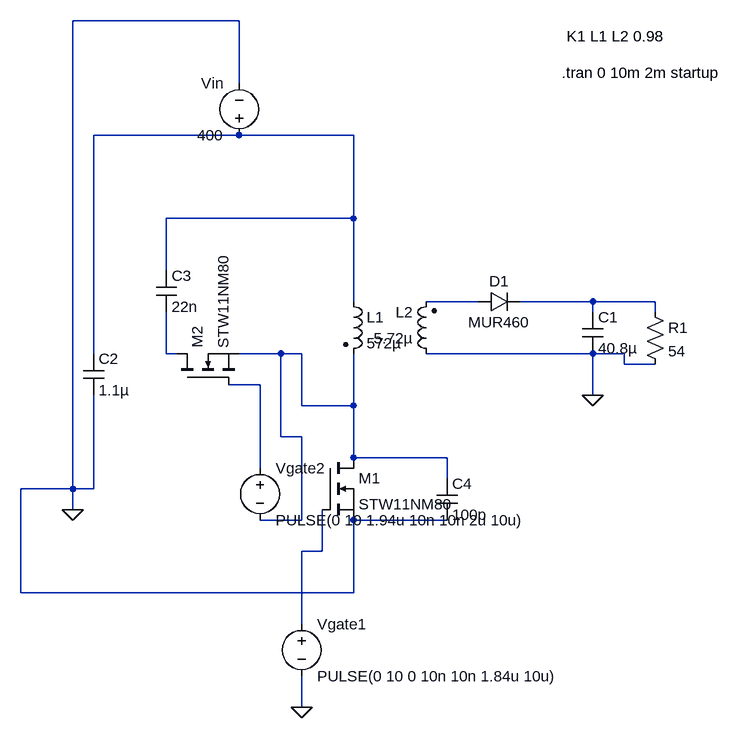
[diagram p0: schematic Draft3.asc]
Draft3.asc, the LTspice schematic file:
Version 4
SHEET 1 880 740
WIRE 0 -336 -256 -336
WIRE 0 -240 0 -336
WIRE 0 -160 -224 -160
WIRE 176 -160 0 -160
WIRE 176 -32 176 -160
WIRE 176 -32 -112 -32
WIRE -112 48 -112 -32
WIRE 176 96 176 -32
WIRE 368 96 288 96
WIRE 544 96 432 96
WIRE 640 96 544 96
WIRE 544 112 544 96
WIRE 640 112 640 96
WIRE -224 176 -224 -160
WIRE -112 176 -112 112
WIRE -96 176 -112 176
WIRE 64 176 0 176
WIRE 96 176 64 176
WIRE 544 176 288 176
WIRE 592 176 544 176
WIRE 592 192 592 176
WIRE 640 192 592 192
WIRE 32 224 -16 224
WIRE 544 240 544 176
WIRE 96 256 96 176
WIRE 176 256 176 176
WIRE 176 256 96 256
WIRE 64 304 64 176
WIRE 96 304 64 304
WIRE 176 336 176 256
WIRE 320 336 176 336
WIRE 32 352 32 224
WIRE 320 368 320 336
WIRE -256 384 -256 -336
WIRE -256 384 -336 384
WIRE -224 384 -224 240
WIRE -224 384 -256 384
WIRE -256 416 -256 384
WIRE 96 432 96 304
WIRE 96 432 32 432
WIRE 320 432 176 432
WIRE 128 480 128 416
WIRE 128 480 96 480
WIRE -336 544 -336 384
WIRE 176 544 176 432
WIRE 176 544 -336 544
WIRE 96 592 96 480
WIRE 96 720 96 672
FLAG -256 416 0
FLAG 96 720 0
FLAG 544 240 0
SYMBOL ind2 160 80 R0
SYMATTR InstName L1
SYMATTR Value 572µ
SYMATTR Type ind
SYMBOL ind2 304 192 R180
WINDOW 0 36 80 Left 2
WINDOW 3 36 40 Left 2
SYMATTR InstName L2
SYMATTR Value 5.72µ
SYMATTR Type ind
SYMBOL diode 368 112 R270
WINDOW 0 32 32 VTop 2
WINDOW 3 0 32 VBottom 2
SYMATTR InstName D1
SYMATTR Value MUR460
SYMBOL cap 528 112 R0
SYMATTR InstName C1
SYMATTR Value 40.8µ
SYMBOL nmos 128 336 R0
SYMATTR InstName M1
SYMATTR Value STW11NM80
SYMBOL nmos -96 224 R270
SYMATTR InstName M2
SYMATTR Value STW11NM80
SYMBOL cap -240 176 R0
SYMATTR InstName C2
SYMATTR Value 1.1µ
SYMBOL cap 304 368 R0
SYMATTR InstName C4
SYMATTR Value 100p
SYMBOL cap -128 48 R0
SYMATTR InstName C3
SYMATTR Value 22n
SYMBOL voltage 0 -144 R180
WINDOW 0 24 96 Left 2
WINDOW 3 24 16 Left 2
WINDOW 123 0 0 Left 0
WINDOW 39 0 0 Left 0
SYMATTR InstName Vin
SYMATTR Value 400
SYMBOL voltage 96 576 R0
WINDOW 123 0 0 Left 0
WINDOW 39 0 0 Left 0
SYMATTR InstName Vgate1
SYMATTR Value PULSE(0 10 0 10n 10n 1.84u 10u)
SYMBOL voltage 32 336 R0
WINDOW 123 0 0 Left 0
WINDOW 39 0 0 Left 0
SYMATTR InstName Vgate2
SYMATTR Value PULSE(0 10 1.94u 10n 10n 2u 10u)
SYMBOL res 624 96 R0
SYMATTR InstName R1
SYMATTR Value 54
TEXT 504 -312 Left 2 !K1 L1 L2 0.98
TEXT 496 -256 Left 2 !.tran 0 10m 2m startup

The netlist it stands for:
* Draft3.asc
L1 N001 N005 572µ
L2 0 N002 5.72µ
D1 N002 N003 MUR460
C1 N003 0 40.8µ
M1 N005 N007 0 0 STW11NM80
M2 N004 N006 N005 N005 STW11NM80
C2 N001 0 1.1µ
C4 N005 0 100p
C3 N001 N004 22n
Vin N001 0 400
Vgate1 N007 0 PULSE(0 10 0 10n 10n 1.84u 10u)
Vgate2 N006 N005 PULSE(0 10 1.94u 10n 10n 2u 10u)
R1 N003 0 54
.model D D
.lib standard.dio
.model NMOS NMOS
.model PMOS PMOS
.lib standard.mos
K1 L1 L2 0.98
.tran 0 10m 2m startup
.backanno
.end